# Altium project DC-DC_Convertor.PrjPcb
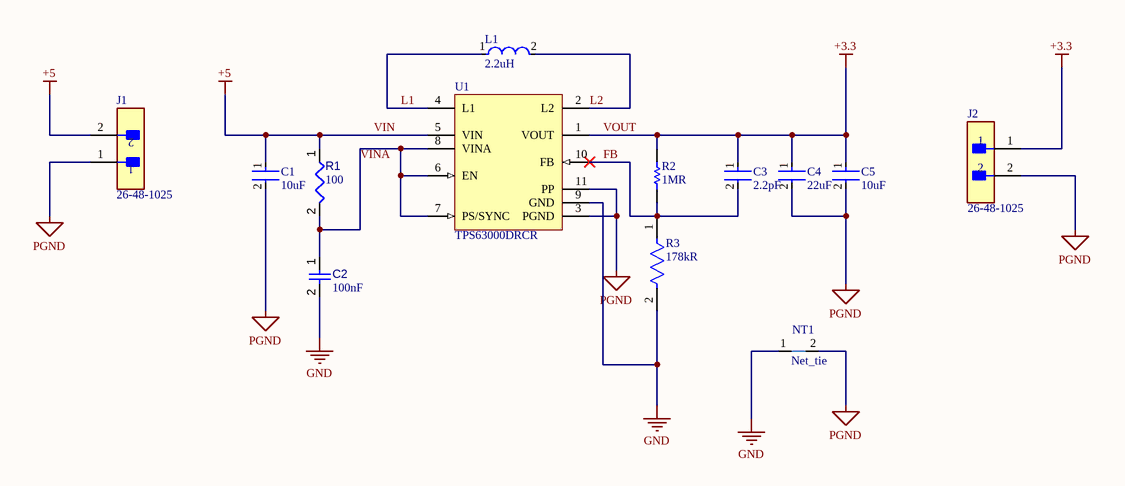
[diagram p0: Sheet1.SchDoc]
1 sheet, 13 parts. Net scope: global (net labels, ports and power ports of the same name join across sheets).
Board file: PCB.PcbDoc

## Sheet Sheet1.SchDoc: DC-DC convertor
size A4; Author: Darshan Jain; DrawnBy: Darshan Jain; Engineer: Darshan Jain; DocumentNumber: 1; Revision: 1; SheetNumber: 1; SheetTotal: 1

### Parts
C1  value 10uF  [FP-CL10-IPC_B]  (hidden comment: CL10A106MQ8NNNC)
C2  value 100nF  [CAPC1608X90X40NL10T20]  (hidden comment: Capacitor 100 nF +/-10% 50 V 0603)
C3  value 2.2pF  [FP-C0603C-CF-IPC_B]  (hidden comment: C0603C229C5GACTU)
C4  value 22uF  [FP-GRM188-0_2-IPC_C]  (hidden comment: GRM188R61A226ME15D)
C5  value 10uF  [FP-CL10-IPC_B]  (hidden comment: CL10A106MQ8NNNC)
J1  26-48-1025  [FP-26-48-1025-MFG]
J2  26-48-1025  [FP-26-48-1025-MFG]
L1  value 2.2uH  [FP-LQH31CN_03-MFG]  (hidden comment: LQH31CN2R2M03L)
NT1  Net_tie  [Net_tie-Footprint-1]  (net tie, no BOM)
R1  value 100  [RESC0402(1005)_L]  (hidden comment: Resistor 100R +/-1 % 0402 63 mW)
R2  value 1MR  [RESC1608X55X25LL10T15]  (hidden comment: RC0603FR-071ML)
R3  value 178kR  [FP-RT0603-IPC_C]  (hidden comment: RT0603DRD07178KL)
U1  TPS63000DRCR  [DRC0010J_V]

### Nets
GND: C2.2 NT1.1 R3.2 U1.9(GND)
PGND: C1.2 C4.2 C5.2 J1.1 J2.2 NT1.2 U1.3(PGND) U1.11(PP)
VIN: C1.1 J1.2 R1.1 U1.5(VIN)  [also labelled +5]
VOUT: C3.1 C4.1 C5.1 J2.1 R2.2 U1.1(VOUT)  [also labelled +3.3]
FB: C3.2 R2.1 R3.1 U1.10(FB)
L1: L1.1 U1.4(L1)
L2: L1.2 U1.2(L2)
VINA: C2.1 R1.2 U1.6(EN) U1.7(PS/SYNC) U1.8(VINA)

### Library data of the parts
C1 C5 = CMP-001-00083-1: Ceramic capacitor SMD-0603 10uF /6.3V X5R# M +-20%, Samsung, RoHS; Dielectric: X5R; Voltage: 6.3V; Tolerance: 20%; Case Code (Metric): 1608; RoHS Compliant: Yes; Series: CL; Packaging: Tape and Reel; Mounting Technology: Surface Mount; Radiation Hardening: No; Voltage Rating: 6.3V; Case Code (Imperial): 0603; Min Operating Temperature: -55°C; Contact Plating: Tin; Case/Package: 0603; Length: 1.6mm; Width: 0.031inch; Max Operating Temperature: 85°C; Thickness: 0.035inch; Construction: Flat; Depth: 0.8mm; Package Quantity: 1; Height: 0.8mm
C2 = CMP-001-00017-6: Chip Capacitor, 100 nF, +/- 10%, 50 V, 0603 (1608 Metric); Voltage Rating: 50V; Capacitor Type: Ceramic; Tolerance: 10%; Mounting Technology: SM; Max Operating Temperature: 125°C; RoHS Compliant: True; Pins: 2; Case/Package: 0603; Min Operating Temperature: -55°C
C3 = CMP-001-00087-1: Ceramic Capacitor 2.2PF 50V, C0G, 0.25PF, 0603, Full Reel; Temperature Coefficient: 30ppm/°C; Dissipation Factor: 0.1%; Lead Pitch: 0.7mm; Dielectric Material: Ceramic; Width: 0.8mm; Series: SMD Comm C0G; Package Quantity: 4000; Height: 0.8mm; Voltage: 50V; Contact Plating: Tin,Matte; Packaging: Tape and Reel; Voltage Rating: 50V; Max Operating Temperature: 125°C; Mounting Technology: Surface Mount; Construction: Flat; Case/Package: 0603; Thickness: 0.034inch; Case Code (Imperial): 0603; Case Code (Metric): 1608; Termination: SMD/SMT; Pins: 2; Depth: 0.8mm; Min Operating Temperature: -55°C; Voltage Rating (DC): 50V; Length: 1.6mm; Dielectric: C0G; Reach SVHC Compliant: No
C4 = CMP-001-00085-1: 0603 22 uF 10 V ±20% Tolerance X5R Multilayer Ceramic Chip Capacitor; Voltage Rating (DC): 10V; Width: 0.8mm; Height: 0.8mm; Lead Free: Lead Free; Packaging: Cut Tape; Case Code (Metric): 1608; Weight: 0.000222oz; Case Code (Imperial): 0603; Length: 1.6mm; Material: Ceramic; Termination: SMD/SMT; Depth: 0.8mm; Case/Package: 0603; Max Operating Temperature: 85°C; Mounting Technology: Surface Mount; Min Operating Temperature: -55°C; Dielectric: X5R; Tolerance: 20%; Series: GRM; RoHS Compliant: Yes; Voltage Rating: 10V; Reach SVHC Compliant: Yes; Thickness: 0.039inch; Package Quantity: 4000
J1 J2 = CMP-002-00071-1: KK 396 Breakaway Header, Vertical, Square Pin, with Friction Lock, 2 Circuits, Tin (Sn) Plating; Approvals: UL,CSA,TUV; Number of Positions: 2; Voltage Rating (AC): 250V; Current Rating: 7A; Pitch: 3.96mm; Gender: Male; Connector Type: Male Pin; Max Current Rating: 6A; Contact Resistance: 10mR; Depth: 9.02mm; Lead Pitch: 3.96mm; Color: Black; Termination: Solder; Contact Plating: Tin,Copper; Mounting Technology: Through Hole; RoHS Compliant: Yes; Orientation: Straight; Packaging: Bulk; Contact Material: Brass; Package Quantity: 100; Radiation Hardening: No; Housing Color: Black; Series: KK® 41671; Flammability Rating: UL94 V-0; Min Operating Temperature: 0°C; Contact Mating Length: 0.45inch; Length: 7.87mm; Max Operating Temperature: 75°C; Number of Rows: 1; Fastening Type: Friction; Number of Contacts: 2; Contact Type: Male Pin; Housing Material: Polyester; Voltage Rating: 250V; Height: 12.8mm
L1 = CMP-006-00022-1: Ind Power Chip Unshielded Wirewound 2.2uH 20% 1MHz Ferrite 430mA 1206 Embossed T/R; Self Resonant Frequency: 50MHz; DC Resistance (DCR): 533mR; Width: 0.063inch; Current Rating: 430mA; Test Frequency: 1MHz; Core Material: Ferrite; Case Code (Imperial): 1206; Height: 1.8mm; Max Operating Temperature: 85°C; Length: 3.2mm; Package Quantity: 2000; Shielding: Unshielded; Weight: 0.001023oz; Max DC Current: 430mA; Depth: 1.8mm; Radiation Hardening: No; Packaging: Tape and Reel; Height - Seated (Max): 0.079inch; Reach SVHC Compliant: No; Min Operating Temperature: -40°C; Mounting Technology: Surface Mount; Termination: SMD/SMT; Inductance Tolerance: 20%; Tolerance: 20%; DC Current: 430mA; Series: LQH31C; Military Standard: Not
NT1 = CMP-019-00050-3
R1 = CMP-009-00167-3: Chip Resistor, 100 Ohms, +/-1 %, 63 mW, -55 to 155 degC, 0402; Power: 63mW; Tolerance: 1%; Min Operating Temperature: -55°C; Case/Package: 0402; Pins: 2; Max Operating Temperature: 155°C
R2 = CMP-009-00177-1: Res Thick Film 0603 1M Ohm 1% 1/10W ±100ppm/°C Molded SMD Paper T/R; Power Rating: 100mW; Voltage Rating (DC): 50V; Voltage Rating: 75V; Temperature Coefficient: 100ppm/°C; Resistor Type: Thick Film; Technology: THICK FILM; Length: 1.6mm; Min Operating Temperature: -55°C; Max Operating Temperature: 155°C; Height: 0.45mm; Weight: 0.000847oz; Reach SVHC Compliant: Yes; Lead Free: Lead Free; Width: 0.8mm; RoHS Compliant: Yes; Series: RC; Military Standard: Not; Case/Package: 0603; Type: General Purpose; Depth: 0.8mm; Packaging: Cut Tape; Package Quantity: 5000; Case Code (Imperial): 0603; Pins: 2; Case Code (Metric): 1608; Termination: SMD/SMT; Tolerance: 1%
R3 = CMP-009-00178-1: Res Thin Film 0603 178K Ohm 0.5% 1/10W ±25ppm/°C Molded SMD Paper T/R; Max Power Dissipation: 100mW; Voltage Rating (DC): 50V; Features: Moisture Resistant; Case Code (Imperial): 0603; Max Operating Temperature: 155°C; RoHS Compliant: Yes; Resistor Type: Thin Film; Series: RT; Min Operating Temperature: -55°C; Lead Free: Lead Free; Packaging: Cut Tape; Width: 0.031inch; Case/Package: 0603; Height: 0.022inch; Tolerance: 0.5%; Number of Terminations: 2; Length: 0.063inch; Temperature Coefficient: 25ppm/°C; Case Code (Metric): 1608; Package Quantity: 1; Power Rating: 100mW
U1 = CMP-019-00049-2: Buck-Boost Switching Regulator IC Positive Adjustable 1.2V 1 Output 1.6A (Switch) 10-VFDFN Exposed Pad; Number of Outputs: 1; Switching Frequency: 1.5MHz; Efficiency: 96%; Quiescent Current: 40uA; Max Output Voltage: 5.5V; Max Output current: 1.2A; Synchronous Rectifier: Yes; Min Input Voltage: 1.8V; Output Type: Adjustable; Case/Package: VSON; Max Operating Temperature: 85°C; Reach SVHC Compliant: Yes; Operating Supply Voltage: 5.5V; Min Output Voltage: 1.2V; RoHS Compliant: Yes; Max Supply Voltage: 5.5V; Output Voltage: 5.5V; Package Quantity: 1; Min Operating Temperature: -40°C; Pins: 10; Output Current: 1.2A; Topology: Buck-Boost